# Altium project shield_io.PrjPcb
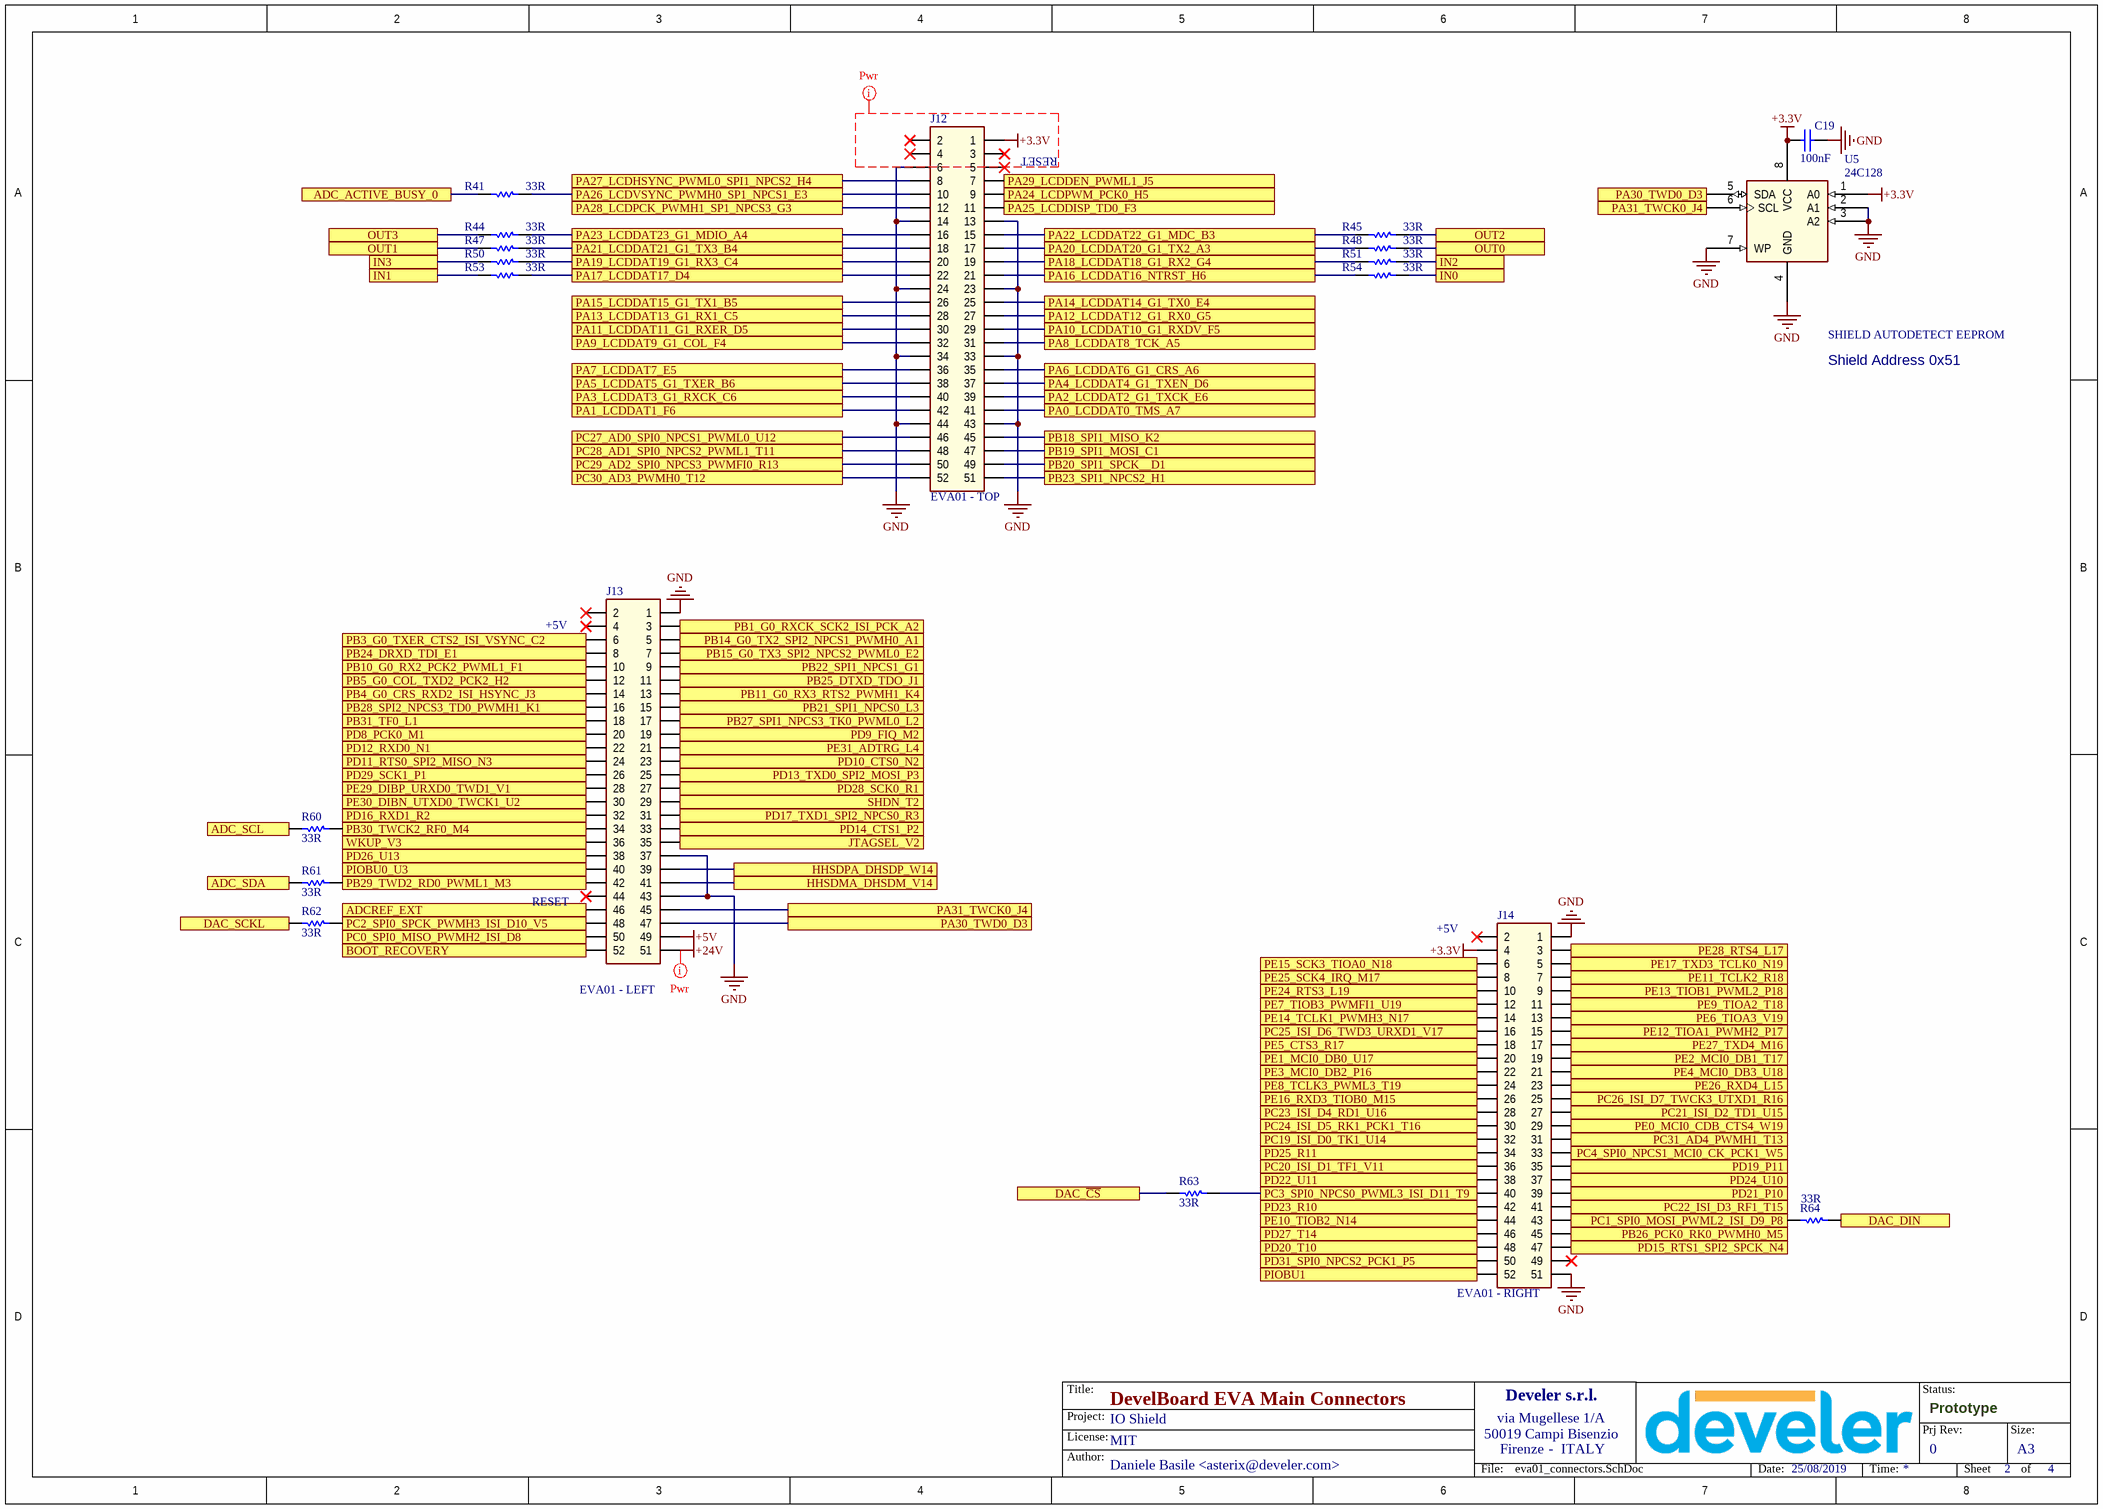
[diagram p0: eva01_connectors.SchDoc]
prj_date: 25/08/2019; prj_hw_ver: 0; prj_license: MIT; prj_name: IO Shield; prj_name_long: Input/Output and Analog expation shield for DevelBoard; prj_pcb: A; prj_pn: -; prj_status: Prototype
5 sheets, 185 parts. Net scope: flat (ports and power ports of the same name join across sheets).
Board file: shield_io.PcbDoc
Sheets:
  eva01_connectors.SchDoc
  adc.SchDoc
  in_out.SchDoc
  connectors.SchDoc
  dac.SchDoc

## Sheet eva01_connectors.SchDoc: DevelBoard EVA Main Connectors
size A3; Author: Daniele Basile <asterix@develer.com>; Organization: Develer s.r.l.; Address1: via Mugellese 1/A; Address2: 50019 Campi Bisenzio; Address3: Firenze; Address4: ITALY; DocumentNumber: 2; Revision: A; SheetNumber: 2; SheetTotal: 4; Hw_rev: R1

### Parts
C19  100nF  [0603_[1608]]
J12  EVA01 - TOP  [SOCKET_2x26_2.54MM_THD]
J13  EVA01 - LEFT  [SOCKET_2x26_2.54MM_THD]
J14  EVA01 - RIGHT  [SOCKET_2x26_2.54MM_THD]
R41  33R  [0603_[1608]]
R44  33R  [0603_[1608]]
R45  33R  [0603_[1608]]
R47  33R  [0603_[1608]]
R48  33R  [0603_[1608]]
R50  33R  [0603_[1608]]
R51  33R  [0603_[1608]]
R53  33R  [0603_[1608]]
R54  33R  [0603_[1608]]
R60  33R  [0603_[1608]]
R61  33R  [0603_[1608]]
R62  33R  [0603_[1608]]
R63  33R  [0603_[1608]]
R64  33R  [0603_[1608]]
U5  24C128  [SOIC8]

### Ports
ADC_ACTIVE_BUSY_0, ADC_SCL, ADC_SDA, ADCREF_EXT, BOOT_RECOVERY, DAC_DIN, DAC_SCKL, DAC_~{CS}, HHSDMA_DHSDM_V14, HHSDPA_DHSDP_W14, IN0, IN1, IN2, IN3, JTAGSEL_V2, OUT0, OUT1, OUT2, OUT3, PA0_LCDDAT0_TMS_A7, PA1_LCDDAT1_F6, PA2_LCDDAT2_G1_TXCK_E6, PA3_LCDDAT3_G1_RXCK_C6, PA4_LCDDAT4_G1_TXEN_D6, PA5_LCDDAT5_G1_TXER_B6, PA6_LCDDAT6_G1_CRS_A6, PA7_LCDDAT7_E5, PA8_LCDDAT8_TCK_A5, PA9_LCDDAT9_G1_COL_F4, PA10_LCDDAT10_G1_RXDV_F5, PA11_LCDDAT11_G1_RXER_D5, PA12_LCDDAT12_G1_RX0_G5, PA13_LCDDAT13_G1_RX1_C5, PA14_LCDDAT14_G1_TX0_E4, PA15_LCDDAT15_G1_TX1_B5, PA16_LCDDAT16_NTRST_H6, PA17_LCDDAT17_D4, PA18_LCDDAT18_G1_RX2_G4, PA19_LCDDAT19_G1_RX3_C4, PA20_LCDDAT20_G1_TX2_A3, PA21_LCDDAT21_G1_TX3_B4, PA22_LCDDAT22_G1_MDC_B3, PA23_LCDDAT23_G1_MDIO_A4, PA24_LCDPWM_PCK0_H5, PA25_LCDDISP_TD0_F3, PA26_LCDVSYNC_PWMH0_SP1_NPCS1_E3, PA27_LCDHSYNC_PWML0_SPI1_NPCS2_H4, PA28_LCDPCK_PWMH1_SP1_NPCS3_G3, PA29_LCDDEN_PWML1_J5, PA30_TWD0_D3, PA31_TWCK0_J4, PB1_G0_RXCK_SCK2_ISI_PCK_A2, PB3_G0_TXER_CTS2_ISI_VSYNC_C2, PB4_G0_CRS_RXD2_ISI_HSYNC_J3, PB5_G0_COL_TXD2_PCK2_H2, PB10_G0_RX2_PCK2_PWML1_F1, PB11_G0_RX3_RTS2_PWMH1_K4, PB14_G0_TX2_SPI2_NPCS1_PWMH0_A1, PB15_G0_TX3_SPI2_NPCS2_PWML0_E2, PB18_SPI1_MISO_K2, PB19_SPI1_MOSI_C1, PB20_SPI1_SPCK__D1, PB21_SPI1_NPCS0_L3, PB22_SPI1_NPCS1_G1, PB23_SPI1_NPCS2_H1, PB24_DRXD_TDI_E1, PB25_DTXD_TDO_J1, PB26_PCK0_RK0_PWMH0_M5, PB27_SPI1_NPCS3_TK0_PWML0_L2, PB28_SPI2_NPCS3_TD0_PWMH1_K1, PB29_TWD2_RD0_PWML1_M3, PB30_TWCK2_RF0_M4, PB31_TF0_L1, PC0_SPI0_MISO_PWMH2_ISI_D8, PC1_SPI0_MOSI_PWML2_ISI_D9_P8, PC2_SPI0_SPCK_PWMH3_ISI_D10_V5, PC3_SPI0_NPCS0_PWML3_ISI_D11_T9, PC4_SPI0_NPCS1_MCI0_CK_PCK1_W5, PC19_ISI_D0_TK1_U14, PC20_ISI_D1_TF1_V11, PC21_ISI_D2_TD1_U15, PC22_ISI_D3_RF1_T15, PC23_ISI_D4_RD1_U16, PC24_ISI_D5_RK1_PCK1_T16, PC25_ISI_D6_TWD3_URXD1_V17, PC26_ISI_D7_TWCK3_UTXD1_R16, PC27_AD0_SPI0_NPCS1_PWML0_U12, PC28_AD1_SPI0_NPCS2_PWML1_T11, PC29_AD2_SPI0_NPCS3_PWMFI0_R13, PC30_AD3_PWMH0_T12, PC31_AD4_PWMH1_T13, PD8_PCK0_M1, PD9_FIQ_M2, PD10_CTS0_N2, PD11_RTS0_SPI2_MISO_N3, PD12_RXD0_N1, PD13_TXD0_SPI2_MOSI_P3, PD14_CTS1_P2, PD15_RTS1_SPI2_SPCK_N4, PD16_RXD1_R2, PD17_TXD1_SPI2_NPCS0_R3, PD19_P11, PD20_T10, PD21_P10, PD22_U11, PD23_R10, PD24_U10, PD25_R11, PD26_U13, PD27_T14, PD28_SCK0_R1, PD29_SCK1_P1, PD31_SPI0_NPCS2_PCK1_P5, PE0_MCI0_CDB_CTS4_W19, PE1_MCI0_DB0_U17, PE2_MCI0_DB1_T17, PE3_MCI0_DB2_P16, PE4_MCI0_DB3_U18, PE5_CTS3_R17, PE6_TIOA3_V19, PE7_TIOB3_PWMFI1_U19, PE8_TCLK3_PWML3_T19, PE9_TIOA2_T18, PE10_TIOB2_N14, PE11_TCLK2_R18, PE12_TIOA1_PWMH2_P17, PE13_TIOB1_PWML2_P18, PE14_TCLK1_PWMH3_N17, PE15_SCK3_TIOA0_N18, PE16_RXD3_TIOB0_M15, PE17_TXD3_TCLK0_N19, PE24_RTS3_L19, PE25_SCK4_IRQ_M17, PE26_RXD4_L15, PE27_TXD4_M16, PE28_RTS4_L17, PE29_DIBP_URXD0_TWD1_V1, PE30_DIBN_UTXD0_TWCK1_U2, PE31_ADTRG_L4, PIOBU0_U3, PIOBU1, SHDN_T2, WKUP_V3

### Nets
+3.3V: C19.2 J12.1 J14.4 U5.1(A0) U5.8(VCC)
+5V: J13.49
+24V: J13.51
GND: C19.1 J12.6 J12.13 J12.14 J12.23 J12.24 J12.33 J12.34 J12.43 J12.44 J13.1 J13.37 J13.43 J14.1 J14.51 U5.2(A1) U5.3(A2) U5.4(GND) U5.7(WP)
ADC_ACTIVE_BUSY_0: R41.2 ; port ADC_ACTIVE_BUSY_0
ADC_SCL: R60.2 ; port ADC_SCL
ADC_SDA: R61.2 ; port ADC_SDA
ADCREF_EXT: J13.46 ; port ADCREF_EXT
BOOT_RECOVERY: J13.52 ; port BOOT_RECOVERY
DAC_~{CS}: R63.2 ; port DAC_~{CS}
DAC_DIN: R64.1 ; port DAC_DIN
DAC_SCKL: R62.2 ; port DAC_SCKL
HHSDMA_DHSDM_V14: J13.41 ; port HHSDMA_DHSDM_V14
HHSDPA_DHSDP_W14: J13.39 ; port HHSDPA_DHSDP_W14
IN0: R54.1 ; port IN0
IN1: R53.2 ; port IN1
IN2: R51.1 ; port IN2
IN3: R50.2 ; port IN3
JTAGSEL_V2: J13.35 ; port JTAGSEL_V2
OUT0: R48.1 ; port OUT0
OUT1: R47.2 ; port OUT1
OUT2: R45.1 ; port OUT2
OUT3: R44.2 ; port OUT3
PA0_LCDDAT0_TMS_A7: J12.41 ; port PA0_LCDDAT0_TMS_A7
PA1_LCDDAT1_F6: J12.42 ; port PA1_LCDDAT1_F6
PA2_LCDDAT2_G1_TXCK_E6: J12.39 ; port PA2_LCDDAT2_G1_TXCK_E6
PA3_LCDDAT3_G1_RXCK_C6: J12.40 ; port PA3_LCDDAT3_G1_RXCK_C6
PA4_LCDDAT4_G1_TXEN_D6: J12.37 ; port PA4_LCDDAT4_G1_TXEN_D6
PA5_LCDDAT5_G1_TXER_B6: J12.38 ; port PA5_LCDDAT5_G1_TXER_B6
PA6_LCDDAT6_G1_CRS_A6: J12.35 ; port PA6_LCDDAT6_G1_CRS_A6
PA7_LCDDAT7_E5: J12.36 ; port PA7_LCDDAT7_E5
PA8_LCDDAT8_TCK_A5: J12.31 ; port PA8_LCDDAT8_TCK_A5
PA9_LCDDAT9_G1_COL_F4: J12.32 ; port PA9_LCDDAT9_G1_COL_F4
PA10_LCDDAT10_G1_RXDV_F5: J12.29 ; port PA10_LCDDAT10_G1_RXDV_F5
PA11_LCDDAT11_G1_RXER_D5: J12.30 ; port PA11_LCDDAT11_G1_RXER_D5
PA12_LCDDAT12_G1_RX0_G5: J12.27 ; port PA12_LCDDAT12_G1_RX0_G5
PA13_LCDDAT13_G1_RX1_C5: J12.28 ; port PA13_LCDDAT13_G1_RX1_C5
PA14_LCDDAT14_G1_TX0_E4: J12.25 ; port PA14_LCDDAT14_G1_TX0_E4
PA15_LCDDAT15_G1_TX1_B5: J12.26 ; port PA15_LCDDAT15_G1_TX1_B5
PA16_LCDDAT16_NTRST_H6: J12.21 R54.2 ; port PA16_LCDDAT16_NTRST_H6
PA17_LCDDAT17_D4: J12.22 R53.1 ; port PA17_LCDDAT17_D4
PA18_LCDDAT18_G1_RX2_G4: J12.19 R51.2 ; port PA18_LCDDAT18_G1_RX2_G4
PA19_LCDDAT19_G1_RX3_C4: J12.20 R50.1 ; port PA19_LCDDAT19_G1_RX3_C4
PA20_LCDDAT20_G1_TX2_A3: J12.17 R48.2 ; port PA20_LCDDAT20_G1_TX2_A3
PA21_LCDDAT21_G1_TX3_B4: J12.18 R47.1 ; port PA21_LCDDAT21_G1_TX3_B4
PA22_LCDDAT22_G1_MDC_B3: J12.15 R45.2 ; port PA22_LCDDAT22_G1_MDC_B3
PA23_LCDDAT23_G1_MDIO_A4: J12.16 R44.1 ; port PA23_LCDDAT23_G1_MDIO_A4
PA24_LCDPWM_PCK0_H5: J12.9 ; port PA24_LCDPWM_PCK0_H5
PA25_LCDDISP_TD0_F3: J12.11 ; port PA25_LCDDISP_TD0_F3
PA26_LCDVSYNC_PWMH0_SP1_NPCS1_E3: J12.10 R41.1 ; port PA26_LCDVSYNC_PWMH0_SP1_NPCS1_E3
PA27_LCDHSYNC_PWML0_SPI1_NPCS2_H4: J12.8 ; port PA27_LCDHSYNC_PWML0_SPI1_NPCS2_H4
PA28_LCDPCK_PWMH1_SP1_NPCS3_G3: J12.12 ; port PA28_LCDPCK_PWMH1_SP1_NPCS3_G3
PA29_LCDDEN_PWML1_J5: J12.7 ; port PA29_LCDDEN_PWML1_J5
PA30_TWD0_D3: J13.47 U5.5(SDA) ; port PA30_TWD0_D3
PA31_TWCK0_J4: J13.45 U5.6(SCL) ; port PA31_TWCK0_J4
PB1_G0_RXCK_SCK2_ISI_PCK_A2: J13.3 ; port PB1_G0_RXCK_SCK2_ISI_PCK_A2
PB3_G0_TXER_CTS2_ISI_VSYNC_C2: J13.6 ; port PB3_G0_TXER_CTS2_ISI_VSYNC_C2
PB4_G0_CRS_RXD2_ISI_HSYNC_J3: J13.14 ; port PB4_G0_CRS_RXD2_ISI_HSYNC_J3
PB5_G0_COL_TXD2_PCK2_H2: J13.12 ; port PB5_G0_COL_TXD2_PCK2_H2
PB10_G0_RX2_PCK2_PWML1_F1: J13.10 ; port PB10_G0_RX2_PCK2_PWML1_F1
PB11_G0_RX3_RTS2_PWMH1_K4: J13.13 ; port PB11_G0_RX3_RTS2_PWMH1_K4
PB14_G0_TX2_SPI2_NPCS1_PWMH0_A1: J13.5 ; port PB14_G0_TX2_SPI2_NPCS1_PWMH0_A1
PB15_G0_TX3_SPI2_NPCS2_PWML0_E2: J13.7 ; port PB15_G0_TX3_SPI2_NPCS2_PWML0_E2
PB18_SPI1_MISO_K2: J12.45 ; port PB18_SPI1_MISO_K2
PB19_SPI1_MOSI_C1: J12.47 ; port PB19_SPI1_MOSI_C1
PB20_SPI1_SPCK__D1: J12.49 ; port PB20_SPI1_SPCK__D1
PB21_SPI1_NPCS0_L3: J13.15 ; port PB21_SPI1_NPCS0_L3
PB22_SPI1_NPCS1_G1: J13.9 ; port PB22_SPI1_NPCS1_G1
PB23_SPI1_NPCS2_H1: J12.51 ; port PB23_SPI1_NPCS2_H1
PB24_DRXD_TDI_E1: J13.8 ; port PB24_DRXD_TDI_E1
PB25_DTXD_TDO_J1: J13.11 ; port PB25_DTXD_TDO_J1
PB26_PCK0_RK0_PWMH0_M5: J14.45 ; port PB26_PCK0_RK0_PWMH0_M5
PB27_SPI1_NPCS3_TK0_PWML0_L2: J13.17 ; port PB27_SPI1_NPCS3_TK0_PWML0_L2
PB28_SPI2_NPCS3_TD0_PWMH1_K1: J13.16 ; port PB28_SPI2_NPCS3_TD0_PWMH1_K1
PB29_TWD2_RD0_PWML1_M3: J13.42 R61.1 ; port PB29_TWD2_RD0_PWML1_M3
PB30_TWCK2_RF0_M4: J13.34 R60.1 ; port PB30_TWCK2_RF0_M4
PB31_TF0_L1: J13.18 ; port PB31_TF0_L1
PC0_SPI0_MISO_PWMH2_ISI_D8: J13.50 ; port PC0_SPI0_MISO_PWMH2_ISI_D8
PC1_SPI0_MOSI_PWML2_ISI_D9_P8: J14.43 R64.2 ; port PC1_SPI0_MOSI_PWML2_ISI_D9_P8
PC2_SPI0_SPCK_PWMH3_ISI_D10_V5: J13.48 R62.1 ; port PC2_SPI0_SPCK_PWMH3_ISI_D10_V5
PC3_SPI0_NPCS0_PWML3_ISI_D11_T9: J14.40 R63.1 ; port PC3_SPI0_NPCS0_PWML3_ISI_D11_T9
PC4_SPI0_NPCS1_MCI0_CK_PCK1_W5: J14.33 ; port PC4_SPI0_NPCS1_MCI0_CK_PCK1_W5
PC19_ISI_D0_TK1_U14: J14.32 ; port PC19_ISI_D0_TK1_U14
PC20_ISI_D1_TF1_V11: J14.36 ; port PC20_ISI_D1_TF1_V11
PC21_ISI_D2_TD1_U15: J14.27 ; port PC21_ISI_D2_TD1_U15
PC22_ISI_D3_RF1_T15: J14.41 ; port PC22_ISI_D3_RF1_T15
PC23_ISI_D4_RD1_U16: J14.28 ; port PC23_ISI_D4_RD1_U16
PC24_ISI_D5_RK1_PCK1_T16: J14.30 ; port PC24_ISI_D5_RK1_PCK1_T16
PC25_ISI_D6_TWD3_URXD1_V17: J14.16 ; port PC25_ISI_D6_TWD3_URXD1_V17
PC26_ISI_D7_TWCK3_UTXD1_R16: J14.25 ; port PC26_ISI_D7_TWCK3_UTXD1_R16
PC27_AD0_SPI0_NPCS1_PWML0_U12: J12.46 ; port PC27_AD0_SPI0_NPCS1_PWML0_U12
PC28_AD1_SPI0_NPCS2_PWML1_T11: J12.48 ; port PC28_AD1_SPI0_NPCS2_PWML1_T11
PC29_AD2_SPI0_NPCS3_PWMFI0_R13: J12.50 ; port PC29_AD2_SPI0_NPCS3_PWMFI0_R13
PC30_AD3_PWMH0_T12: J12.52 ; port PC30_AD3_PWMH0_T12
PC31_AD4_PWMH1_T13: J14.31 ; port PC31_AD4_PWMH1_T13
PD8_PCK0_M1: J13.20 ; port PD8_PCK0_M1
PD9_FIQ_M2: J13.19 ; port PD9_FIQ_M2
PD10_CTS0_N2: J13.23 ; port PD10_CTS0_N2
PD11_RTS0_SPI2_MISO_N3: J13.24 ; port PD11_RTS0_SPI2_MISO_N3
PD12_RXD0_N1: J13.22 ; port PD12_RXD0_N1
PD13_TXD0_SPI2_MOSI_P3: J13.25 ; port PD13_TXD0_SPI2_MOSI_P3
PD14_CTS1_P2: J13.33 ; port PD14_CTS1_P2
PD15_RTS1_SPI2_SPCK_N4: J14.47 ; port PD15_RTS1_SPI2_SPCK_N4
PD16_RXD1_R2: J13.32 ; port PD16_RXD1_R2
PD17_TXD1_SPI2_NPCS0_R3: J13.31 ; port PD17_TXD1_SPI2_NPCS0_R3
PD19_P11: J14.35 ; port PD19_P11
PD20_T10: J14.48 ; port PD20_T10
PD21_P10: J14.39 ; port PD21_P10
PD22_U11: J14.38 ; port PD22_U11
PD23_R10: J14.42 ; port PD23_R10
PD24_U10: J14.37 ; port PD24_U10
PD25_R11: J14.34 ; port PD25_R11
PD26_U13: J13.38 ; port PD26_U13
PD27_T14: J14.46 ; port PD27_T14
PD28_SCK0_R1: J13.27 ; port PD28_SCK0_R1
PD29_SCK1_P1: J13.26 ; port PD29_SCK1_P1
PD31_SPI0_NPCS2_PCK1_P5: J14.50 ; port PD31_SPI0_NPCS2_PCK1_P5
PE0_MCI0_CDB_CTS4_W19: J14.29 ; port PE0_MCI0_CDB_CTS4_W19
PE1_MCI0_DB0_U17: J14.20 ; port PE1_MCI0_DB0_U17
PE2_MCI0_DB1_T17: J14.19 ; port PE2_MCI0_DB1_T17
PE3_MCI0_DB2_P16: J14.22 ; port PE3_MCI0_DB2_P16
PE4_MCI0_DB3_U18: J14.21 ; port PE4_MCI0_DB3_U18
PE5_CTS3_R17: J14.18 ; port PE5_CTS3_R17
PE6_TIOA3_V19: J14.13 ; port PE6_TIOA3_V19
PE7_TIOB3_PWMFI1_U19: J14.12 ; port PE7_TIOB3_PWMFI1_U19
PE8_TCLK3_PWML3_T19: J14.24 ; port PE8_TCLK3_PWML3_T19
PE9_TIOA2_T18: J14.11 ; port PE9_TIOA2_T18
PE10_TIOB2_N14: J14.44 ; port PE10_TIOB2_N14
PE11_TCLK2_R18: J14.7 ; port PE11_TCLK2_R18
PE12_TIOA1_PWMH2_P17: J14.15 ; port PE12_TIOA1_PWMH2_P17
PE13_TIOB1_PWML2_P18: J14.9 ; port PE13_TIOB1_PWML2_P18
PE14_TCLK1_PWMH3_N17: J14.14 ; port PE14_TCLK1_PWMH3_N17
PE15_SCK3_TIOA0_N18: J14.6 ; port PE15_SCK3_TIOA0_N18
PE16_RXD3_TIOB0_M15: J14.26 ; port PE16_RXD3_TIOB0_M15
PE17_TXD3_TCLK0_N19: J14.5 ; port PE17_TXD3_TCLK0_N19
PE24_RTS3_L19: J14.10 ; port PE24_RTS3_L19
PE25_SCK4_IRQ_M17: J14.8 ; port PE25_SCK4_IRQ_M17
PE26_RXD4_L15: J14.23 ; port PE26_RXD4_L15
PE27_TXD4_M16: J14.17 ; port PE27_TXD4_M16
PE28_RTS4_L17: J14.3 ; port PE28_RTS4_L17
PE29_DIBP_URXD0_TWD1_V1: J13.28 ; port PE29_DIBP_URXD0_TWD1_V1
PE30_DIBN_UTXD0_TWCK1_U2: J13.30 ; port PE30_DIBN_UTXD0_TWCK1_U2
PE31_ADTRG_L4: J13.21 ; port PE31_ADTRG_L4
PIOBU0_U3: J13.40 ; port PIOBU0_U3
PIOBU1: J14.52 ; port PIOBU1
SHDN_T2: J13.29 ; port SHDN_T2
WKUP_V3: J13.36 ; port WKUP_V3

Not connected (* = marked no-connect by the designer): J12 2* 3* 4* 5*; J13 2* 4* 44*; J14 2* 49*

### Layout directives
net class Power: +3.3V, +24V

### Notes on the sheet
- (near J12) RESET
- SHIELD AUTODETECT EEPROM
- Shield Address 0x51
- (near J13) +5V
- (near J13) RESET
- (near J14) +5V
- Title:
- Status:
- Author:
- License:
- Project:
- -
- Prj Rev:
- Size:
- A3
- File:
- Date:
- Time:
- Sheet
- of

### Library data of the parts
C19 = Cap: Ceramic X7R 50V; Value: 10nF; Published: 8-Jun-2000; Revision: July-2002: Re-released for DXP Platform.; Publisher: Altium Limited
J12-J14 = Header 26x2: Socket Header, 52 pin, 26x2, 2.54mm, H=8.5mm; Part Number: Tyco 1-1634688; Purchase Code: RS 473-8254
R41 R44 R45 R47 R48 R50 R51 R53 R54 R60-R64 = Res1: Resistor; Revision: July-2002: Re-released for DXP Platform.
U5 = EEPROM-SOIC8: EEPROM

## Sheet adc.SchDoc: ADC and current shunts
size A3; Author: Daniele Basile <asterix@develer.com>; Organization: Develer s.r.l.; Address1: via Mugellese 1/A; Address2: 50019 Campi Bisenzio; Address3: Firenze; Address4: ITALY; DocumentNumber: 4; Revision: A; SheetNumber: 4; SheetTotal: 4; Hw_rev: R1
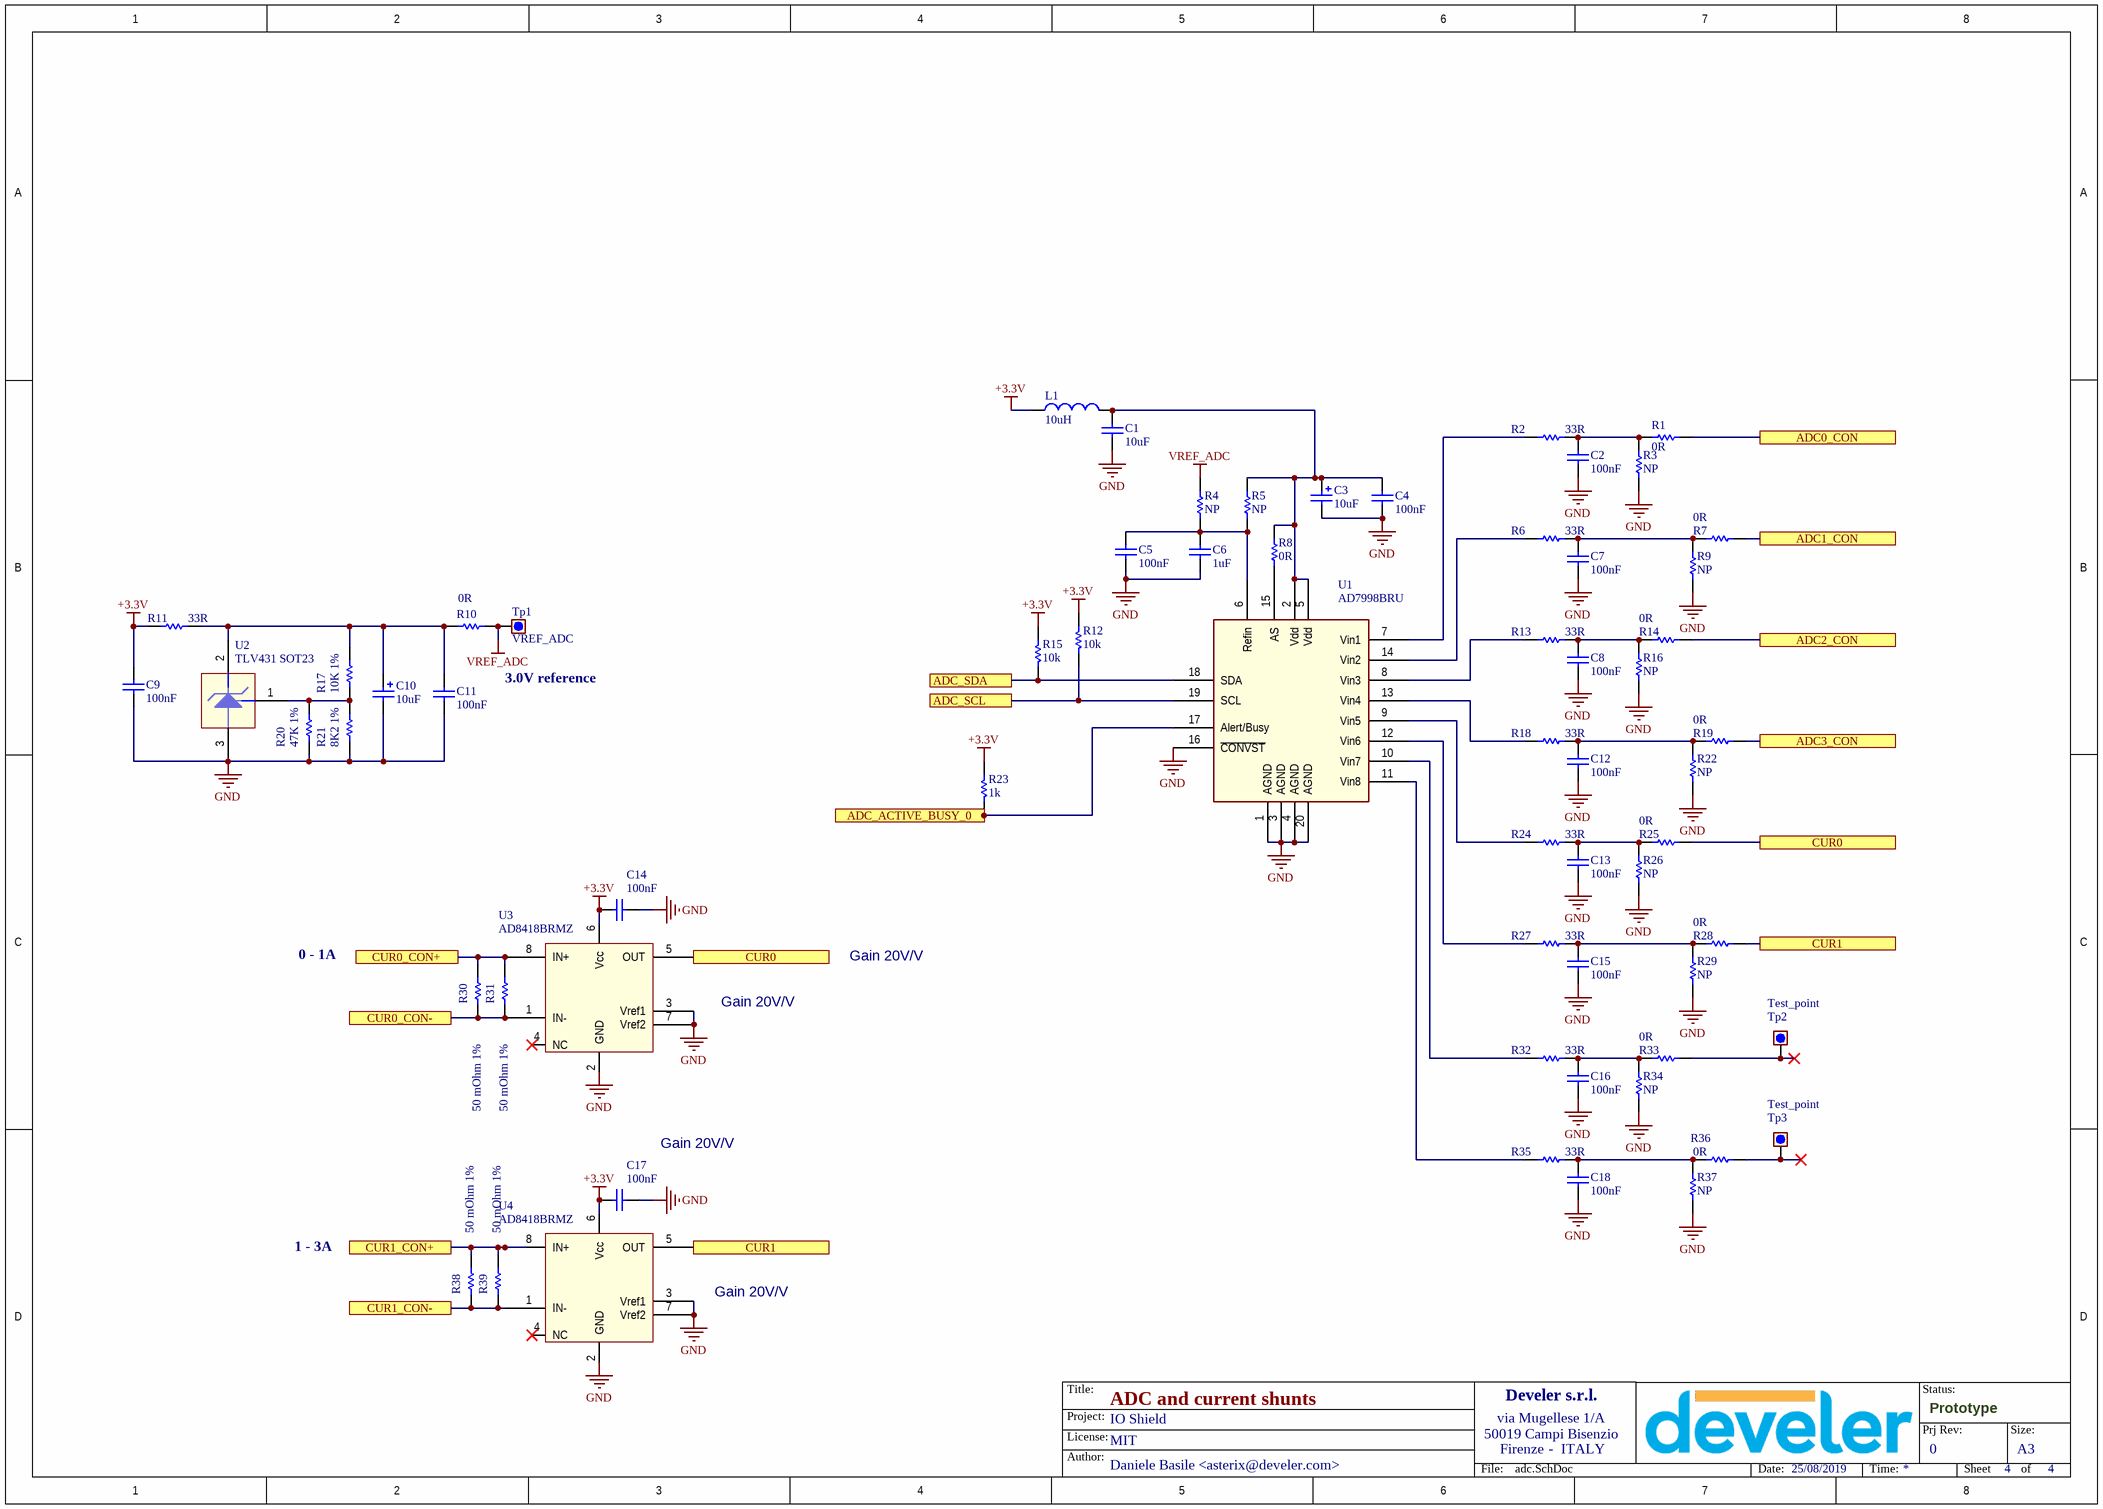
[diagram p1: adc.SchDoc]

### Parts
C1  10uF  [1206_[3216]]
C2  100nF  [0603_[1608]]
C3  10uF  [0805_[2012]]
C4  100nF  [0603_[1608]]
C5  100nF  [0603_[1608]]
C6  1uF  [0603_[1608]]
C7  100nF  [0603_[1608]]
C8  100nF  [0603_[1608]]
C9  100nF  [0603_[1608]]
C10  10uF  [0805_[2012]]
C11  100nF  [0603_[1608]]
C12  100nF  [0603_[1608]]
C13  100nF  [0603_[1608]]
C14  100nF  [0603_[1608]]
C15  100nF  [0603_[1608]]
C16  100nF  [0603_[1608]]
C17  100nF  [0603_[1608]]
C18  100nF  [0603_[1608]]
L1  10uH  [1210_[3225]]
R1  0R  [0603_[1608]]
R2  33R  [0603_[1608]]
R3  NP  [0603_[1608]]
R4  NP  [0603_[1608]]
R5  NP  [0603_[1608]]
R6  33R  [0603_[1608]]
R7  0R  [0603_[1608]]
R8  0R  [0603_[1608]]
R9  NP  [0603_[1608]]
R10  0R  [0603_[1608]]
R11  33R  [0603_[1608]]
R12  10k  [0603_[1608]]
R13  33R  [0603_[1608]]
R14  0R  [0603_[1608]]
R15  10k  [0603_[1608]]
R16  NP  [0603_[1608]]
R17  10K 1%  [0603_[1608]]
R18  33R  [0603_[1608]]
R19  0R  [0603_[1608]]
R20  47K 1%  [0603_[1608]]
R21  8K2 1%  [0603_[1608]]
R22  NP  [0603_[1608]]
R23  1k  [0603_[1608]]
R24  33R  [0603_[1608]]
R25  0R  [0603_[1608]]
R26  NP  [0603_[1608]]
R27  33R  [0603_[1608]]
R28  0R  [0603_[1608]]
R29  NP  [0603_[1608]]
R30  50 mOhm 1%  [1210_[3225]]
R31  50 mOhm 1%  [1210_[3225]]
R32  33R  [0603_[1608]]
R33  0R  [0603_[1608]]
R34  NP  [0603_[1608]]
R35  33R  [0603_[1608]]
R36  0R  [0603_[1608]]
R37  NP  [0603_[1608]]
R38  50 mOhm 1%  [1210_[3225]]
R39  50 mOhm 1%  [1210_[3225]]
Tp1  VREF_ADC  [TEST_POINT_THD_D1.6MM]  (no BOM)
Tp2  Test_point  [TEST_POINT_THD_D1.6MM]  (no BOM)
Tp3  Test_point  [TEST_POINT_THD_D1.6MM]  (no BOM)
U1  AD7998BRU  [TSOP65P640X120-20L]
U2  TLV431 SOT23  [SOT-23]
U3  AD8418BRMZ  [MSOP65P490X110-8P]
U4  AD8418BRMZ  [MSOP65P490X110-8P]

### Ports
ADC0_CON, ADC1_CON, ADC2_CON, ADC3_CON, ADC_ACTIVE_BUSY_0, ADC_SCL, ADC_SDA, CUR0, CUR0_CON+, CUR0_CON-, CUR1, CUR1_CON+, CUR1_CON-

### Nets
+3.3V: C9.2 C14.2 C17.2 L1.1 R11.2 R12.2 R15.2 R23.2 U3.6(Vcc) U4.6(Vcc)
GND: C1.1 C2.1 C3.2 C4.1 C5.1 C6.1 C7.1 C8.1 C9.1 C10.2 C11.1 C12.1 C13.1 C14.1 C15.1 C16.1 C17.1 C18.1 R3.2 R9.2 R16.2 R20.2 R21.1 R22.2 R26.2 R29.2 R34.2 R37.2 U1.1(AGND) U1.3(AGND) U1.4(AGND) U1.16(~{CONVST}) U1.20(AGND) U2.3(A) U3.2(GND) U3.3(Vref1) U3.7(Vref2) U4.2(GND) U4.3(Vref1) U4.7(Vref2)
VREF_ADC: R4.2 R10.2 Tp1.1
ADC0_CON: R1.1 ; port ADC0_CON
ADC1_CON: R7.1 ; port ADC1_CON
ADC2_CON: R14.1 ; port ADC2_CON
ADC3_CON: R19.1 ; port ADC3_CON
ADC_ACTIVE_BUSY_0: R23.1 U1.17(Alert/Busy) ; port ADC_ACTIVE_BUSY_0
ADC_SCL: R12.1 U1.19(SCL) ; port ADC_SCL
ADC_SDA: R15.1 U1.18(SDA) ; port ADC_SDA
CUR0: R25.1 U3.5(OUT) ; port CUR0
CUR0_CON+: R30.2 R31.2 U3.8(IN+) ; port CUR0_CON+
CUR0_CON-: R30.1 R31.1 U3.1(IN-) ; port CUR0_CON-
CUR1: R28.1 U4.5(OUT) ; port CUR1
CUR1_CON+: R38.2 R39.2 U4.8(IN+) ; port CUR1_CON+
CUR1_CON-: R38.1 R39.1 U4.1(IN-) ; port CUR1_CON-
NetC1_2: C1.2 C3.1 C4.2 L1.2 R5.2 R8.2 U1.2(Vdd) U1.5(Vdd)
NetC2_2: C2.2 R1.2 R2.2 R3.1
NetC5_2: C5.2 C6.2 R4.1 R5.1 U1.6(Refin)
NetC7_2: C7.2 R6.2 R7.2 R9.1
NetC8_2: C8.2 R13.2 R14.2 R16.1
NetC10_1: C10.1 C11.2 R10.1 R11.1 R17.1 U2.2(K)
NetC12_2: C12.2 R18.2 R19.2 R22.1
NetC13_2: C13.2 R24.2 R25.2 R26.1
NetC15_2: C15.2 R27.2 R28.2 R29.1
NetC16_2: C16.2 R32.2 R33.2 R34.1
NetC18_2: C18.2 R35.2 R36.2 R37.1
NetR2_1: R2.1 U1.7(Vin1)
NetR6_1: R6.1 U1.14(Vin2)
NetR8_1: R8.1 U1.15(AS)
NetR13_1: R13.1 U1.8(Vin3)
NetR17_2: R17.2 R20.1 R21.2 U2.1(REF)
NetR18_1: R18.1 U1.13(Vin4)
NetR24_1: R24.1 U1.9(Vin5)
NetR27_1: R27.1 U1.12(Vin6)
NetR32_1: R32.1 U1.10(Vin7)
NetR33_1: R33.1 Tp2.1
NetR35_1: R35.1 U1.11(Vin8)
NetR36_1: R36.1 Tp3.1

Not connected (* = marked no-connect by the designer): U3 4(NC)*; U4 4(NC)*

### Notes on the sheet
- 3.0V reference
- 0 - 1A
- Gain 20V/V
- 1 - 3A
- Title:
- Status:
- Author:
- License:
- Project:
- -
- Prj Rev:
- Size:
- A3
- File:
- Date:
- Time:
- Sheet
- of

### Library data of the parts
C1 = Cap: Ceramic X7R 25V; Value: 100pF; Published: 8-Jun-2000; LatestRevisionDate: 17-Jul-2002; LatestRevisionNote: Re-released for DXP Platform.; PackageReference: RAD-0.3; Publisher: Altium Limited; PackageDescription: Radial Cap, Thru-Hole; 2 Leads; 0.3 in Pin Spacing
C2 C4 C5 C7 C8 C11-C18 = Cap: Ceramic X7R 50V; Value: 100pF; Published: 8-Jun-2000; LatestRevisionDate: 17-Jul-2002; LatestRevisionNote: Re-released for DXP Platform.; PackageReference: RAD-0.3; Publisher: Altium Limited; PackageDescription: Radial Cap, Thru-Hole; 2 Leads; 0.3 in Pin Spacing
C3 C10 = Cap Pol1: Ceramic X5R 10V; Published: 8-Jun-2000; Revision: July-2002: Re-released for DXP Platform.; Publisher: Altium Limited
C6 = Cap: Ceramic X5R 25V; Value: 100pF; Published: 8-Jun-2000; LatestRevisionDate: 17-Jul-2002; LatestRevisionNote: Re-released for DXP Platform.; PackageReference: RAD-0.3; Publisher: Altium Limited; PackageDescription: Radial Cap, Thru-Hole; 2 Leads; 0.3 in Pin Spacing
C9 = Cap: Ceramic X7R 50V; Published: 8-Jun-2000; LatestRevisionDate: 17-Jul-2002; LatestRevisionNote: Re-released for DXP Platform.; PackageReference: RAD-0.3; Publisher: Altium Limited; PackageDescription: Radial Cap, Thru-Hole; 2 Leads; 0.3 in Pin Spacing
L1 = Inductor: INDUCTOR, 1210 CASE, 10.0UH (ELJPA100KF); Code_IEC: 1005; Value: 10mH; Published: 8-Jun-2000; LatestRevisionDate: 29-May-2009; LatestRevisionNote: IPC-7351 Footprint Added.; PackageReference: 0402-A; Publisher: Altium Limited; PackageDescription: Chip Inductor; Code_JEITA: 0402
R1 = Res1: Resistor; Value: 1K; Published: 8-Jun-2000; Revision: July-2002: Re-released for DXP Platform.; Publisher: Altium Limited
R2-R39 = Res1: Resistor
  R2 R4-R6 R8 R10 R11 R13 R17 R18 R20 R21 R24 R27 R32 R35: Published: 8-Jun-2000; LatestRevisionDate: 17-Jul-2002; LatestRevisionNote: Re-released for DXP Platform.; PackageReference: AXIAL-0.3; Publisher: Altium Limited; PackageDescription: Axial Device, Thru-Hole; 2 Leads; 0.3 in Pin Spacing
  R3 R7 R9 R12 R14-R16 R19 R22 R23 R25 R26 R28-R31 R33 R34 R36-R39: Revision: July-2002: Re-released for DXP Platform.
Tp1-Tp3 = Test_point: Test point
U1 = AD799x: ADC 12bit I2C
U2 = TLV431 3pin: TLV431BQDBZT
U3 U4 = AD8414: 12bit DAC

## Sheet in_out.SchDoc: Relays and digital input
size A3; Author: Daniele Basile <asterix@develer.com>; Organization: Develer s.r.l.; Address1: via Mugellese 1/A; Address2: 50019 Campi Bisenzio; Address3: Firenze; Address4: ITALY; DocumentNumber: 3; Revision: A; SheetNumber: 3; SheetTotal: 4; Hw_rev: R1
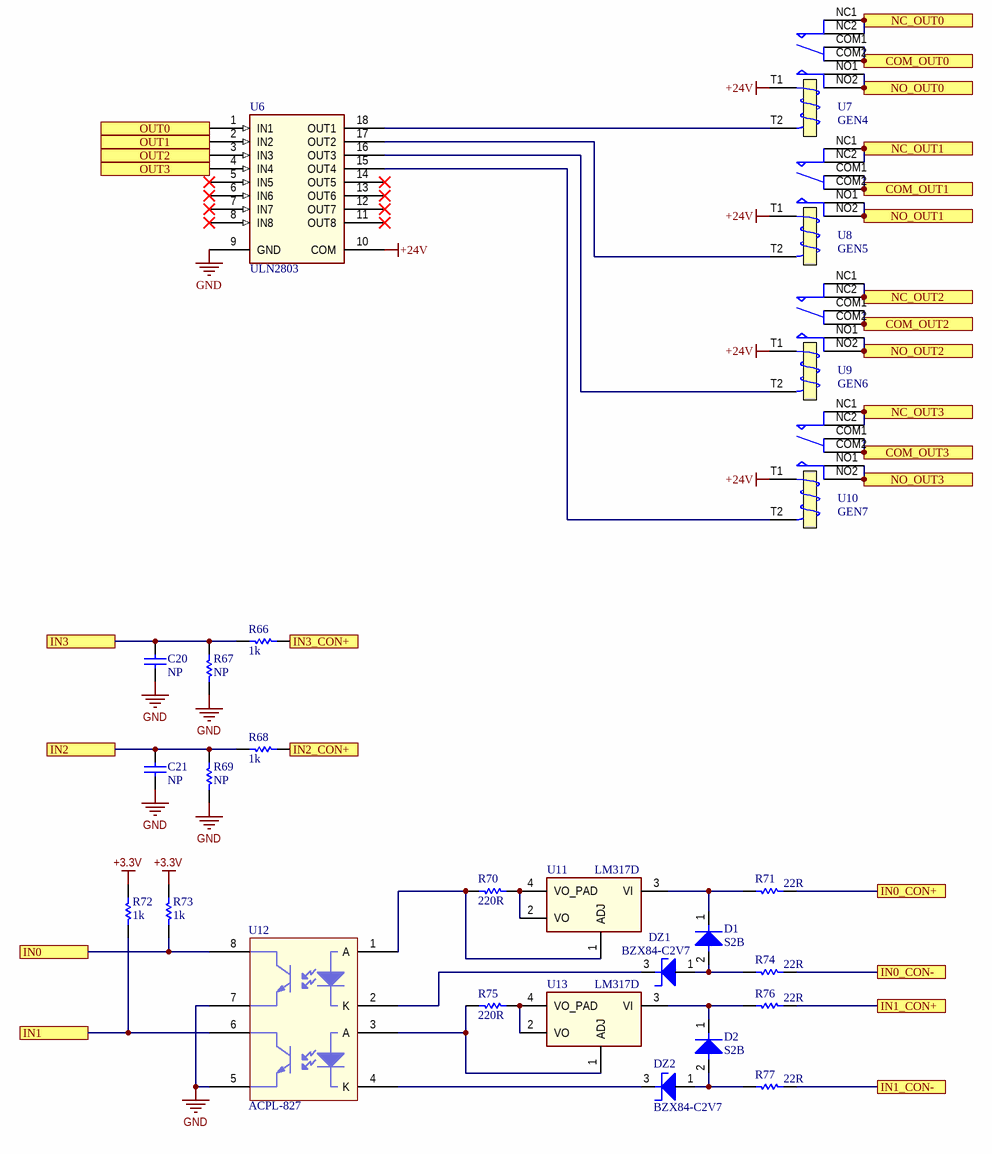
[diagram p2: in_out.SchDoc]

### Parts
C20  NP  [0603_[1608]]
C21  NP  [0603_[1608]]
D1  S2B  [DO214AA_K1-A2_SMB]
D2  S2B  [DO214AA_K1-A2_SMB]
DZ1  BZX84-C2V7  [SOT-23]
DZ2  BZX84-C2V7  [SOT-23]
R66  1k  [0603_[1608]]
R67  NP  [0603_[1608]]
R68  1k  [0603_[1608]]
R69  NP  [0603_[1608]]
R70  220R  [0603_[1608]]
R71  22R  [0603_[1608]]
R72  1k  [0603_[1608]]
R73  1k  [0603_[1608]]
R74  22R  [0603_[1608]]
R75  220R  [0603_[1608]]
R76  22R  [0603_[1608]]
R77  22R  [0603_[1608]]
U6  ULN2803  [SOIC18]
U7  GEN4  [relays_spco_thd_28x12mm_5mm]
U8  GEN5  [relays_spco_thd_28x12mm_5mm]
U9  GEN6  [relays_spco_thd_28x12mm_5mm]
U10  GEN7  [relays_spco_thd_28x12mm_5mm]
U11  LM317D  [SOT-223]
U12  ACPL-827  [SOIC8_OPTO]
U13  LM317D  [SOT-223]

### Ports
COM_OUT0, COM_OUT1, COM_OUT2, COM_OUT3, IN0, IN0_CON+, IN0_CON-, IN1, IN1_CON+, IN1_CON-, IN2, IN2_CON+, IN3, IN3_CON+, NC_OUT0, NC_OUT1, NC_OUT2, NC_OUT3, NO_OUT0, NO_OUT1, NO_OUT2, NO_OUT3, OUT0, OUT1, OUT2, OUT3

### Nets
+3.3V: R72.2 R73.2
+24V: U6.10(COM) U7.T1 U8.T1 U9.T1 U10.T1
GND: C20.1 C21.1 R67.1 R69.1 U6.9(GND) U12.5 U12.7
COM_OUT0: U7.COM1 U7.COM2 ; port COM_OUT0
COM_OUT1: U8.COM1 U8.COM2 ; port COM_OUT1
COM_OUT2: U9.COM1 U9.COM2 ; port COM_OUT2
COM_OUT3: U10.COM1 U10.COM2 ; port COM_OUT3
IN0: R73.1 U12.8 ; port IN0
IN0_CON+: R71.2 ; port IN0_CON+
IN0_CON-: R74.2 ; port IN0_CON-
IN1: R72.1 U12.6 ; port IN1
IN1_CON+: R76.2 ; port IN1_CON+
IN1_CON-: R77.2 ; port IN1_CON-
IN2: C21.2 R68.2 R69.2 ; port IN2
IN2_CON+: R68.1 ; port IN2_CON+
IN3: C20.2 R66.2 R67.2 ; port IN3
IN3_CON+: R66.1 ; port IN3_CON+
NC_OUT0: U7.NC1 U7.NC2 ; port NC_OUT0
NC_OUT1: U8.NC1 U8.NC2 ; port NC_OUT1
NC_OUT2: U9.NC1 U9.NC2 ; port NC_OUT2
NC_OUT3: U10.NC1 U10.NC2 ; port NC_OUT3
NO_OUT0: U7.NO1 U7.NO2 ; port NO_OUT0
NO_OUT1: U8.NO1 U8.NO2 ; port NO_OUT1
NO_OUT2: U9.NO1 U9.NO2 ; port NO_OUT2
NO_OUT3: U10.NO1 U10.NO2 ; port NO_OUT3
OUT0: U6.1(IN1) ; port OUT0
OUT1: U6.2(IN2) ; port OUT1
OUT2: U6.3(IN3) ; port OUT2
OUT3: U6.4(IN4) ; port OUT3
NetD1_1: D1.1(K) R71.1 U11.3(VI)
NetD1_2: D1.2(A) DZ1.1(A) R74.1
NetD2_1: D2.1(K) R76.1 U13.3(VI)
NetD2_2: D2.2(A) DZ2.1(A) R77.1
NetDZ1_3: DZ1.3(K) U12.2(K)
NetDZ2_3: DZ2.3(K) U12.4(K)
NetR70_1: R70.1 U11.1(ADJ) U12.1(A)
NetR70_2: R70.2 U11.2(VO) U11.4(VO_PAD)
NetR75_1: R75.1 U12.3(A) U13.1(ADJ)
NetR75_2: R75.2 U13.2(VO) U13.4(VO_PAD)
NetU6_15: U6.15(OUT4) U10.T2
NetU6_16: U6.16(OUT3) U9.T2
NetU6_17: U6.17(OUT2) U8.T2
NetU6_18: U6.18(OUT1) U7.T2

Not connected (* = marked no-connect by the designer): U6 5(IN5)* 6(IN6)* 7(IN7)* 8(IN8)* 11(OUT8)* 12(OUT7)* 13(OUT6)* 14(OUT5)*

### Notes on the sheet
- Title:
- Status:
- Author:
- License:
- Project:
- -
- Prj Rev:
- Size:
- A3
- File:
- Date:
- Time:
- Sheet
- of

### Library data of the parts
C20 C21 = Cap: Ceramic X7R 50V; Value: 100pF; Published: 8-Jun-2000; LatestRevisionDate: 17-Jul-2002; LatestRevisionNote: Re-released for DXP Platform.; PackageReference: RAD-0.3; Publisher: Altium Limited; PackageDescription: Radial Cap, Thru-Hole; 2 Leads; 0.3 in Pin Spacing
D1 D2 = Diode: S2B Diode
DZ1 DZ2 = ZENER_BZX: Zener 2,7V
R66-R77 = Res1: Resistor; Revision: July-2002: Re-released for DXP Platform.
U6 = ULN2803: BJT Darlinton Array
U7-U10 = Relay SPCO_8pin: Rele NT75CS16DC12V0.415.0 16A 12V
U11 U13 = LM317: 3-Terminal Adjustable Regulator, 3-pin SOT-223; case: THD
U12 = optocoupler 2ch: Optocoupler

## Sheet connectors.SchDoc: Terminal Block connectors
size A3; Author: Daniele Basile <asterix@develer.com>; Organization: Altium Limited; Address1: L3, 12a Rodborough Rd; Address2: Frenchs Forest; Address3: NSW; Address4: Australia 2086; DocumentNumber: 1; SheetNumber: 1; SheetTotal: 4; Hw_rev: R1
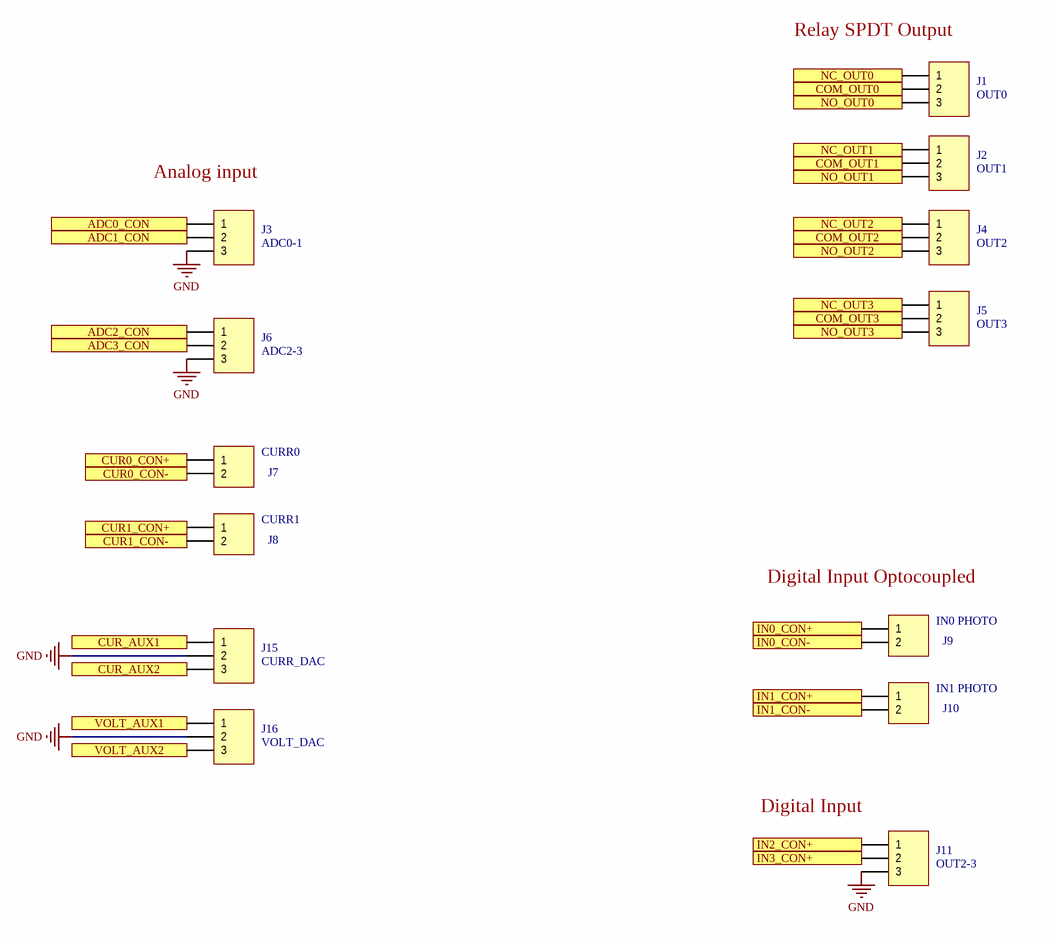
[diagram p3: connectors.SchDoc]

### Parts
J1  OUT0  [TBLOCK_1X3_3.5MM_HOR_THD]
J2  OUT1  [TBLOCK_1X3_3.5MM_HOR_THD]
J3  ADC0-1  [TBLOCK_1X3_3.5MM_HOR_THD]
J4  OUT2  [TBLOCK_1X3_3.5MM_HOR_THD]
J5  OUT3  [TBLOCK_1X3_3.5MM_HOR_THD]
J6  ADC2-3  [TBLOCK_1X3_3.5MM_HOR_THD]
J7  CURR0  [TBLOCK_1X2_3.5MM_HOR_THD]
J8  CURR1  [TBLOCK_1X2_3.5MM_HOR_THD]
J9  IN0 PHOTO  [TBLOCK_1X2_3.5MM_HOR_THD]
J10  IN1 PHOTO  [TBLOCK_1X2_3.5MM_HOR_THD]
J11  OUT2-3  [TBLOCK_1X3_3.5MM_HOR_THD]
J15  CURR_DAC  [TBLOCK_1X3_3.5MM_HOR_THD]
J16  VOLT_DAC  [TBLOCK_1X3_3.5MM_HOR_THD]

### Ports
ADC0_CON, ADC1_CON, ADC2_CON, ADC3_CON, COM_OUT0, COM_OUT1, COM_OUT2, COM_OUT3, CUR0_CON+, CUR0_CON-, CUR1_CON+, CUR1_CON-, CUR_AUX1, CUR_AUX2, IN0_CON+, IN0_CON-, IN1_CON+, IN1_CON-, IN2_CON+, IN3_CON+, NC_OUT0, NC_OUT1, NC_OUT2, NC_OUT3, NO_OUT0, NO_OUT1, NO_OUT2, NO_OUT3, VOLT_AUX1, VOLT_AUX2

### Nets
GND: J3.3 J6.3 J11.3 J15.2 J16.2
ADC0_CON: J3.1 ; port ADC0_CON
ADC1_CON: J3.2 ; port ADC1_CON
ADC2_CON: J6.1 ; port ADC2_CON
ADC3_CON: J6.2 ; port ADC3_CON
COM_OUT0: J1.2 ; port COM_OUT0
COM_OUT1: J2.2 ; port COM_OUT1
COM_OUT2: J4.2 ; port COM_OUT2
COM_OUT3: J5.2 ; port COM_OUT3
CUR0_CON+: J7.1 ; port CUR0_CON+
CUR0_CON-: J7.2 ; port CUR0_CON-
CUR1_CON+: J8.1 ; port CUR1_CON+
CUR1_CON-: J8.2 ; port CUR1_CON-
CUR_AUX1: J15.1 ; port CUR_AUX1
CUR_AUX2: J15.3 ; port CUR_AUX2
IN0_CON+: J9.1 ; port IN0_CON+
IN0_CON-: J9.2 ; port IN0_CON-
IN1_CON+: J10.1 ; port IN1_CON+
IN1_CON-: J10.2 ; port IN1_CON-
IN2_CON+: J11.1 ; port IN2_CON+
IN3_CON+: J11.2 ; port IN3_CON+
NC_OUT0: J1.1 ; port NC_OUT0
NC_OUT1: J2.1 ; port NC_OUT1
NC_OUT2: J4.1 ; port NC_OUT2
NC_OUT3: J5.1 ; port NC_OUT3
NO_OUT0: J1.3 ; port NO_OUT0
NO_OUT1: J2.3 ; port NO_OUT1
NO_OUT2: J4.3 ; port NO_OUT2
NO_OUT3: J5.3 ; port NO_OUT3
VOLT_AUX1: J16.1 ; port VOLT_AUX1
VOLT_AUX2: J16.3 ; port VOLT_AUX2

### Notes on the sheet
- (near J1) Relay SPDT Output
- (near J3) Analog input
- (near J9) Digital Input Optocoupled
- (near J11) Digital Input
- Title:
- Status:
- Author:
- License:
- Project:
- -
- Prj Rev:
- Size:
- A3
- File:
- Date:
- Time:
- Sheet
- of

### Library data of the parts
J1-J6 J11 J15 J16 = Header 3: Terminal block Header 3.5mm Horizonta; LatestRevisionDate: 17-Jul-2002; LatestRevisionNote: Re-released for DXP Platform.; Publisher: Altium Limited
J7-J10 = Header 2: Terminal block Header 3.5mm Horizontal (WE 691322110002); LatestRevisionDate: 17-Jul-2002; LatestRevisionNote: Re-released for DXP Platform.; Publisher: Altium Limited

## Sheet dac.SchDoc: DAC output
size A3; Author: Daniele Basile <asterix@develer.com>; Organization: Develer s.r.l.; Address1: via Mugellese 1/A; Address2: 50019 Campi Bisenzio; Address3: Firenze; Address4: ITALY; DocumentNumber: 9; Revision: A; SheetNumber: 9; SheetTotal: 10; Hw_rev: R1
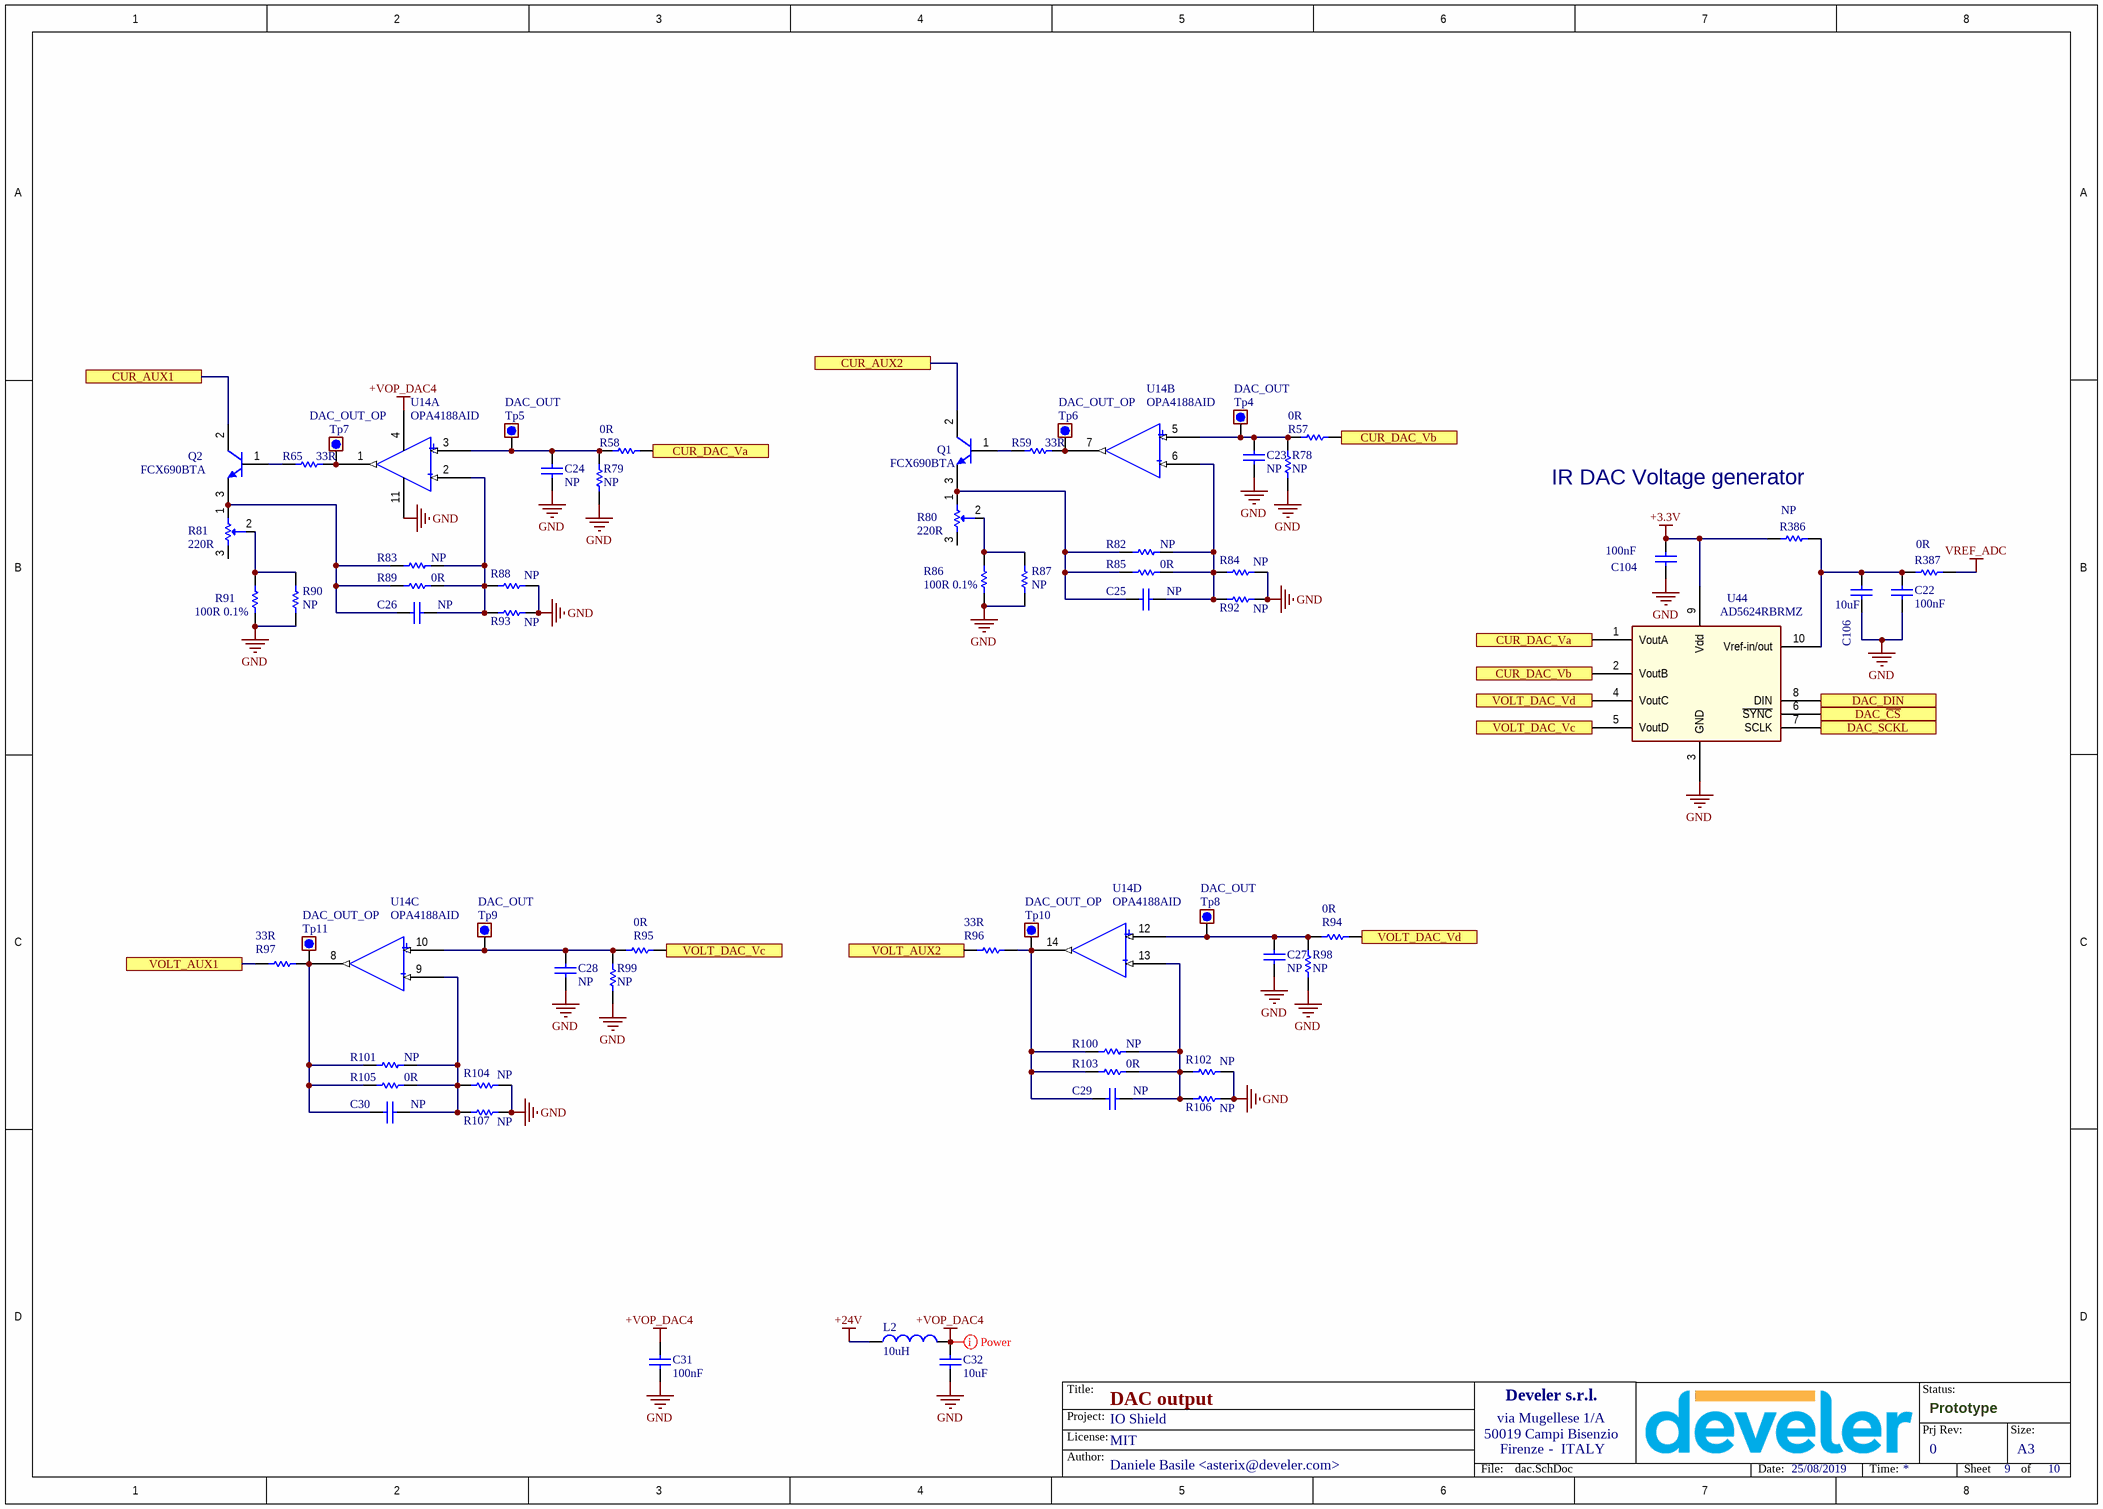
[diagram p4: dac.SchDoc]

### Parts
C22  100nF  [0603_[1608]]
C23  NP  [0603_[1608]]
C24  NP  [0603_[1608]]
C25  NP  [0603_[1608]]
C26  NP  [0603_[1608]]
C27  NP  [0603_[1608]]
C28  NP  [0603_[1608]]
C29  NP  [0603_[1608]]
C30  NP  [0603_[1608]]
C31  100nF  [0603_[1608]]
C32  10uF  [1206_[3216]]
C104  100nF  [0603_[1608]]
C106  10uF  [1206_[3216]]
L2  10uH  [1210_[3225]]
Q1  FCX690BTA  [SOT-89]
Q2  FCX690BTA  [SOT-89]
R57  0R  [0603_[1608]]
R58  0R  [0603_[1608]]
R59  33R  [0603_[1608]]
R65  33R  [0603_[1608]]
R78  NP  [0603_[1608]]
R79  NP  [0603_[1608]]
R80  220R  [TRIMMER_THD_5x10MM_HORIZONTAL]
R81  220R  [TRIMMER_THD_5x10MM_HORIZONTAL]
R82  NP  [0603_[1608]]
R83  NP  [0603_[1608]]
R84  NP  [0603_[1608]]
R85  0R  [0603_[1608]]
R86  100R 0.1%  [0805_[2012]]
R87  NP  [0805_[2012]]
R88  NP  [0603_[1608]]
R89  0R  [0603_[1608]]
R90  NP  [0805_[2012]]
R91  100R 0.1%  [0805_[2012]]
R92  NP  [0603_[1608]]
R93  NP  [0603_[1608]]
R94  0R  [0603_[1608]]
R95  0R  [0603_[1608]]
R96  33R  [0603_[1608]]
R97  33R  [0603_[1608]]
R98  NP  [0603_[1608]]
R99  NP  [0603_[1608]]
R100  NP  [0603_[1608]]
R101  NP  [0603_[1608]]
R102  NP  [0603_[1608]]
R103  0R  [0603_[1608]]
R104  NP  [0603_[1608]]
R105  0R  [0603_[1608]]
R106  NP  [0603_[1608]]
R107  NP  [0603_[1608]]
R386  NP  [0603_[1608]]
R387  0R  [0603_[1608]]
Tp4  DAC_OUT  [TEST_POINT_THD_D1.6MM]  (no BOM)
Tp5  DAC_OUT  [TEST_POINT_THD_D1.6MM]  (no BOM)
Tp6  DAC_OUT_OP  [TEST_POINT_THD_D1.6MM]  (no BOM)
Tp7  DAC_OUT_OP  [TEST_POINT_THD_D1.6MM]  (no BOM)
Tp8  DAC_OUT  [TEST_POINT_THD_D1.6MM]  (no BOM)
Tp9  DAC_OUT  [TEST_POINT_THD_D1.6MM]  (no BOM)
Tp10  DAC_OUT_OP  [TEST_POINT_THD_D1.6MM]  (no BOM)
Tp11  DAC_OUT_OP  [TEST_POINT_THD_D1.6MM]  (no BOM)
U14  OPA4188AID  [SOIC14]  (parts A,B,C,D of 4)
U44  AD5624RBRMZ  [MSOP50P490X110-10P]

### Ports
CUR_AUX1, CUR_AUX2, CUR_DAC_Va, CUR_DAC_Vb, DAC_DIN, DAC_SCKL, DAC_~{CS}, VOLT_AUX1, VOLT_AUX2, VOLT_DAC_Vc, VOLT_DAC_Vd

### Nets
+3.3V: C104.2 R386.2 U44.9(Vdd)
+24V: L2.1
+VOP_DAC4: C31.1 C32.2 L2.2 U14.4(V+)
GND: C22.2 C23.2 C24.2 C27.2 C28.2 C31.2 C32.1 C104.1 C106.1 R78.2 R79.2 R84.2 R86.1 R87.1 R88.2 R90.1 R91.1 R92.2 R93.2 R98.2 R99.2 R102.2 R104.2 R106.2 R107.2 U14.11(V-) U44.3(GND)
VREF_ADC: R387.1
CUR_AUX1: Q2.2(C) ; port CUR_AUX1
CUR_AUX2: Q1.2(C) ; port CUR_AUX2
CUR_DAC_Va: R58.1 U44.1(VoutA) ; port CUR_DAC_Va
CUR_DAC_Vb: R57.1 U44.2(VoutB) ; port CUR_DAC_Vb
DAC_~{CS}: U44.6(~{SYNC}) ; port DAC_~{CS}
DAC_DIN: U44.8(DIN) ; port DAC_DIN
DAC_SCKL: U44.7(SCLK) ; port DAC_SCKL
VOLT_AUX1: R97.1 ; port VOLT_AUX1
VOLT_AUX2: R96.1 ; port VOLT_AUX2
VOLT_DAC_Vc: R95.1 U44.5(VoutD) ; port VOLT_DAC_Vc
VOLT_DAC_Vd: R94.1 U44.4(VoutC) ; port VOLT_DAC_Vd
NetC22_1: C22.1 C106.2 R386.1 R387.2 U44.10(Vref-in/out)
NetC23_1: C23.1 R57.2 R78.1 Tp4.1 U14.5(IN+)
NetC24_1: C24.1 R58.2 R79.1 Tp5.1 U14.3(IN+)
NetC25_1: C25.1 R82.2 R84.1 R85.2 R92.1 U14.6(IN-)
NetC25_2: C25.2 Q1.3(E) R80.1 R82.1 R85.1
NetC26_1: C26.1 R83.2 R88.1 R89.2 R93.1 U14.2(IN-)
NetC26_2: C26.2 Q2.3(E) R81.1 R83.1 R89.1
NetC27_1: C27.1 R94.2 R98.1 Tp8.1 U14.12(IN+)
NetC28_1: C28.1 R95.2 R99.1 Tp9.1 U14.10(IN+)
NetC29_1: C29.1 R100.2 R102.1 R103.2 R106.1 U14.13(IN-)
NetC29_2: C29.2 R96.2 R100.1 R103.1 Tp10.1 U14.14(OUT)
NetC30_1: C30.1 R101.2 R104.1 R105.2 R107.1 U14.9(IN-)
NetC30_2: C30.2 R97.2 R101.1 R105.1 Tp11.1 U14.8(OUT)
NetQ1_1: Q1.1(B) R59.1
NetQ2_1: Q2.1(B) R65.1
NetR59_2: R59.2 Tp6.1 U14.7(OUT)
NetR65_2: R65.2 Tp7.1 U14.1(OUT)
NetR80_2: R80.2 R86.2 R87.2
NetR81_2: R81.2 R90.2 R91.2

Not connected (* = marked no-connect by the designer): R80 3; R81 3

### Layout directives
net class Power: +VOP_DAC4

### Notes on the sheet
- IR DAC Voltage generator
- Title:
- Status:
- Author:
- License:
- Project:
- -
- Prj Rev:
- Size:
- A3
- File:
- Date:
- Time:
- Sheet
- of
- (in symbol OpAmp, part A) +; -
- (in symbol OpAmp, part B) +; -
- (in symbol OpAmp, part C) +; -
- (in symbol OpAmp, part D) +; -

### Library data of the parts
C22-C31 C104 = Cap: Ceramic X7R 50V; Value: 100pF; Published: 8-Jun-2000; LatestRevisionDate: 17-Jul-2002; LatestRevisionNote: Re-released for DXP Platform.; PackageReference: RAD-0.3; Publisher: Altium Limited; PackageDescription: Radial Cap, Thru-Hole; 2 Leads; 0.3 in Pin Spacing
C32 C106 = Cap: Ceramic X7R 25V; Value: 100pF; Published: 8-Jun-2000; LatestRevisionDate: 17-Jul-2002; LatestRevisionNote: Re-released for DXP Platform.; PackageReference: RAD-0.3; Publisher: Altium Limited; PackageDescription: Radial Cap, Thru-Hole; 2 Leads; 0.3 in Pin Spacing
L2 = Inductor: as L1 on sheet adc; Published: 8-Jun-2000; LatestRevisionDate: 29-May-2009; LatestRevisionNote: IPC-7351 Footprint Added.; PackageReference: 0402-A; Publisher: Altium Limited; PackageDescription: Chip Inductor; Code_JEITA: 0402
Q1 Q2 = NPN: NPN Bipolar Transistor; Published: 8-Jun-2000; LatestRevisionDate: 17-Jul-2002; LatestRevisionNote: Re-released for DXP Platform.; PackageReference: TO-226-AA; Publisher: Altium Limited; PackageDescription: TO, Flat Index; 3 In-Line, Axial Leads; Body Dia. 4.8mm; Leads 0.55 x 0.51 mm (max); Code_JEDEC: TO-226-AA
R57-R59 R65 R78 R79 R82-R107 R386 R387 = Res1: Resistor; Revision: July-2002: Re-released for DXP Platform.
R80 R81 = Trimmer_3p: Trimmer 23 Turn 220ohm (T93YA221KT20;)
Tp4-Tp11 = Test_point: Test point
U14 = OpAmp: Quad Op Amp
U44 = AD5624R_BRMZ_MSOP: 12bit DAC

## Nets that join several sheets
+3.3V: eva01_connectors (5 pins), adc (10 pins), in_out (R72.2 R73.2), dac (C104.2 R386.2 U44.9)
+24V: eva01_connectors (J13.51), in_out (5 pins), dac (L2.1)
GND: eva01_connectors (19 pins), adc (40 pins), in_out (7 pins), connectors (5 pins), dac (27 pins)
VREF_ADC: adc (R4.2 R10.2 Tp1.1), dac (R387.1)
ADC0_CON: adc (R1.1), connectors (J3.1)
ADC1_CON: adc (R7.1), connectors (J3.2)
ADC2_CON: adc (R14.1), connectors (J6.1)
ADC3_CON: adc (R19.1), connectors (J6.2)
ADC_ACTIVE_BUSY_0: eva01_connectors (R41.2), adc (R23.1 U1.17)
ADC_SCL: eva01_connectors (R60.2), adc (R12.1 U1.19)
ADC_SDA: eva01_connectors (R61.2), adc (R15.1 U1.18)
COM_OUT0: in_out (U7.COM1 U7.COM2), connectors (J1.2)
COM_OUT1: in_out (U8.COM1 U8.COM2), connectors (J2.2)
COM_OUT2: in_out (U9.COM1 U9.COM2), connectors (J4.2)
COM_OUT3: in_out (U10.COM1 U10.COM2), connectors (J5.2)
CUR0_CON+: adc (R30.2 R31.2 U3.8), connectors (J7.1)
CUR0_CON-: adc (R30.1 R31.1 U3.1), connectors (J7.2)
CUR1_CON+: adc (R38.2 R39.2 U4.8), connectors (J8.1)
CUR1_CON-: adc (R38.1 R39.1 U4.1), connectors (J8.2)
CUR_AUX1: connectors (J15.1), dac (Q2.2)
CUR_AUX2: connectors (J15.3), dac (Q1.2)
DAC_~{CS}: eva01_connectors (R63.2), dac (U44.6)
DAC_DIN: eva01_connectors (R64.1), dac (U44.8)
DAC_SCKL: eva01_connectors (R62.2), dac (U44.7)
IN0: eva01_connectors (R54.1), in_out (R73.1 U12.8)
IN0_CON+: in_out (R71.2), connectors (J9.1)
IN0_CON-: in_out (R74.2), connectors (J9.2)
IN1: eva01_connectors (R53.2), in_out (R72.1 U12.6)
IN1_CON+: in_out (R76.2), connectors (J10.1)
IN1_CON-: in_out (R77.2), connectors (J10.2)
IN2: eva01_connectors (R51.1), in_out (C21.2 R68.2 R69.2)
IN2_CON+: in_out (R68.1), connectors (J11.1)
IN3: eva01_connectors (R50.2), in_out (C20.2 R66.2 R67.2)
IN3_CON+: in_out (R66.1), connectors (J11.2)
NC_OUT0: in_out (U7.NC1 U7.NC2), connectors (J1.1)
NC_OUT1: in_out (U8.NC1 U8.NC2), connectors (J2.1)
NC_OUT2: in_out (U9.NC1 U9.NC2), connectors (J4.1)
NC_OUT3: in_out (U10.NC1 U10.NC2), connectors (J5.1)
NO_OUT0: in_out (U7.NO1 U7.NO2), connectors (J1.3)
NO_OUT1: in_out (U8.NO1 U8.NO2), connectors (J2.3)
NO_OUT2: in_out (U9.NO1 U9.NO2), connectors (J4.3)
NO_OUT3: in_out (U10.NO1 U10.NO2), connectors (J5.3)
OUT0: eva01_connectors (R48.1), in_out (U6.1)
OUT1: eva01_connectors (R47.2), in_out (U6.2)
OUT2: eva01_connectors (R45.1), in_out (U6.3)
OUT3: eva01_connectors (R44.2), in_out (U6.4)
VOLT_AUX1: connectors (J16.1), dac (R97.1)
VOLT_AUX2: connectors (J16.3), dac (R96.1)